# EAGLE design 454_mic (EAGLE 9.6.2)
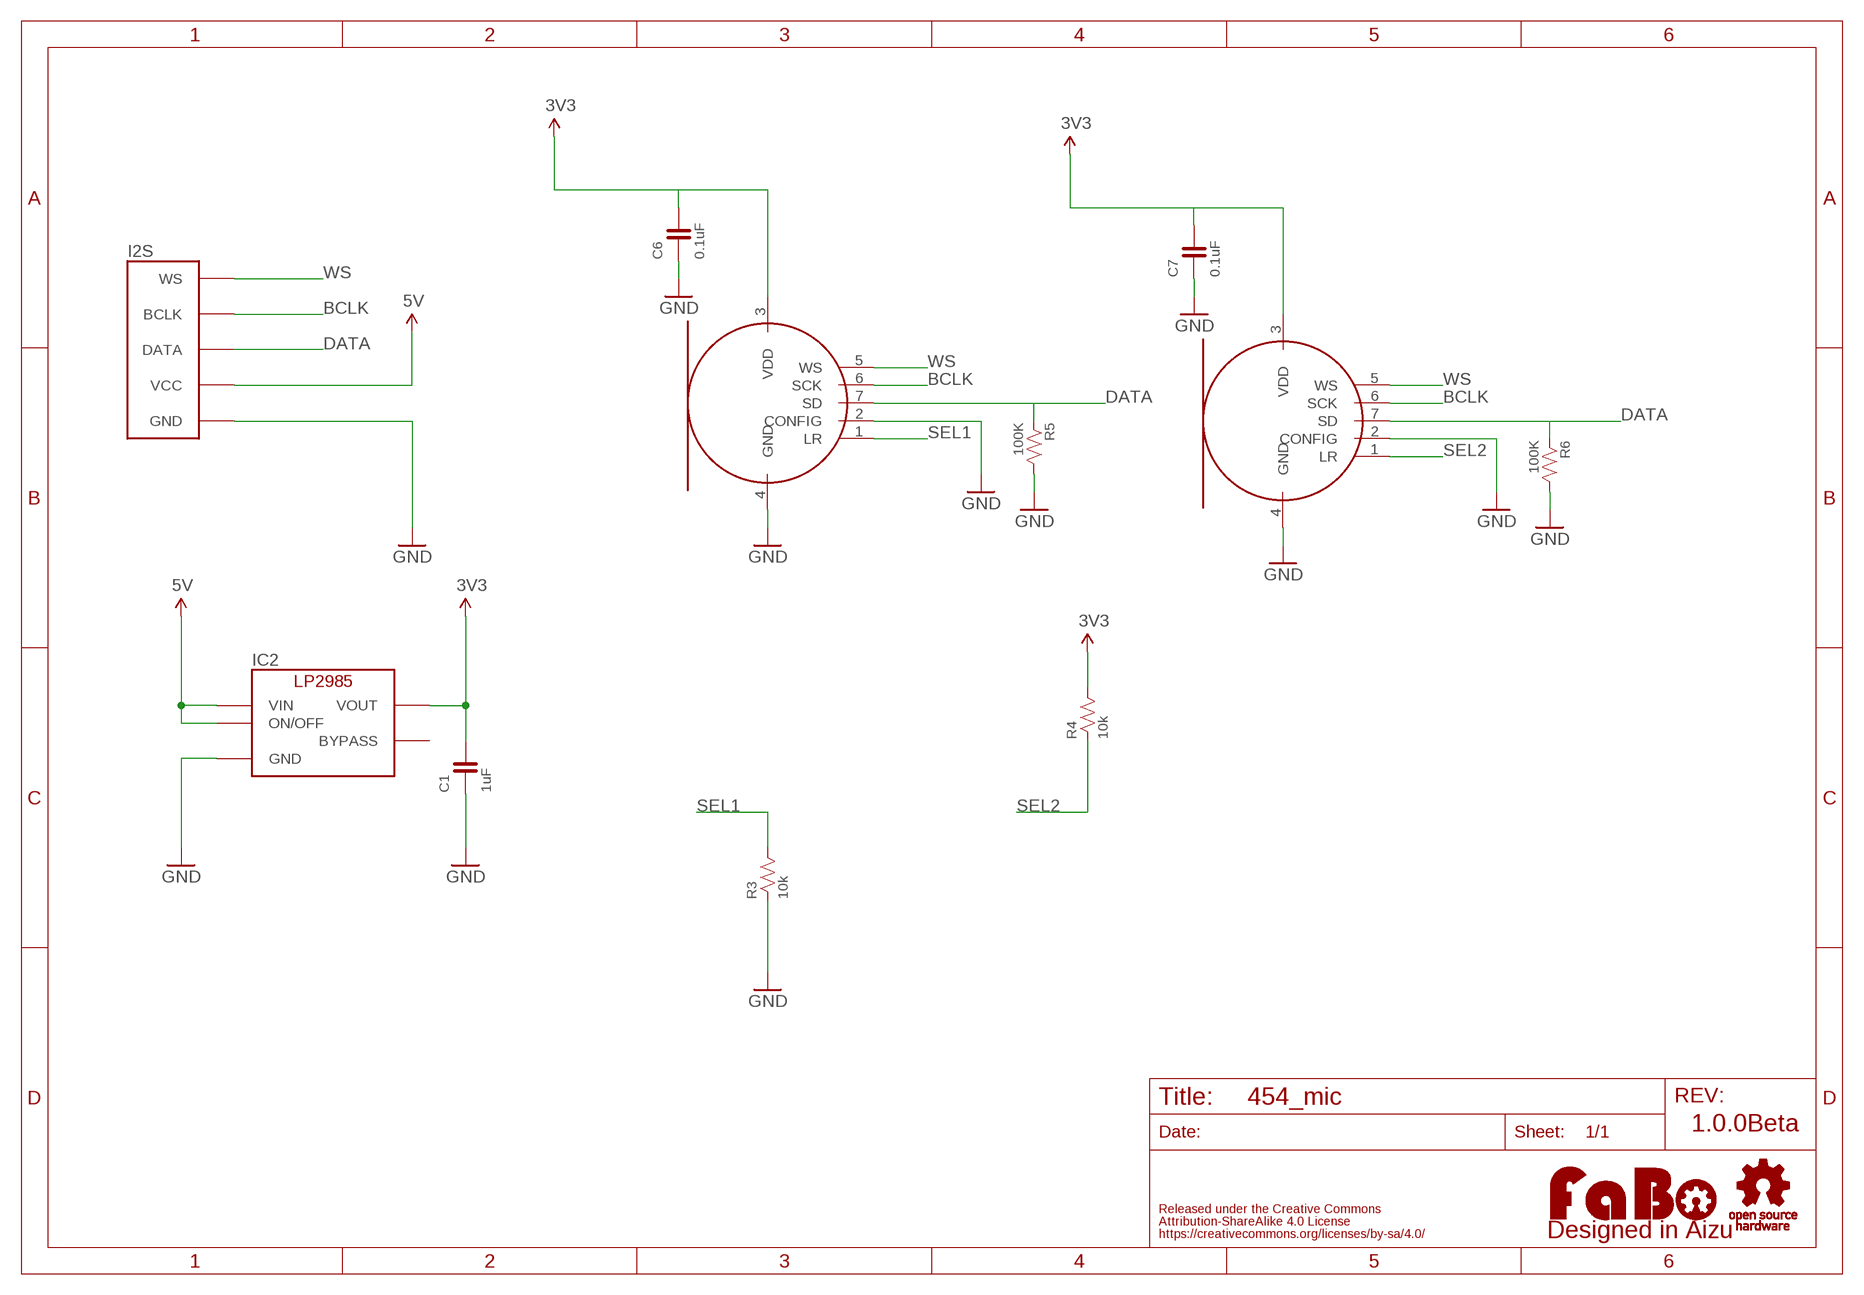
[diagram p0: schematic, sheet 1]

## Parts
C1  1uF  CAPACITOR-0603  [0603]
C6  0.1uF  CAPACITOR-0603  [0603]
C7  0.1uF  CAPACITOR-0603  [0603]
I2S  FABO_BRICK_I2STOP  [FABO_BRICK_I2S_B05B-PARK-1]
IC2  LP2985-33DBV  [SOT-23-5]
LOGO1  LOGO_FABO-M_BOTTOM  [LOGO_FABO_M_BOTTOM]
MIC_LEFT  TDK-ICS43432  [TDK-ICS43432]
MIC_RIGHT  TDK-ICS43432  [TDK-ICS43432]
R3  10k  RESISTOR-0603  [0603]
R4  10k  RESISTOR-0603  [0603]
R5  100K  RESISTOR-0603  [0603]
R6  100K  RESISTOR-0603  [0603]
U$2  LOGO_OSHW-M  [LOGO_OSHW_M]

## Nets
3V3: C1.2 C6.2 C7.2 IC2.5(VOUT) MIC_LEFT.3(VDD) MIC_RIGHT.3(VDD) R4.2
5V: I2S.VCC IC2.1(VIN) IC2.3(ON/OFF)
BCLK: I2S.BCLK MIC_LEFT.6(SCK) MIC_RIGHT.6(SCK)
DATA: I2S.DATA MIC_LEFT.7(SD) MIC_RIGHT.7(SD) R5.1 R6.1
GND: C1.1 C6.1 C7.1 I2S.GND IC2.2(GND) MIC_LEFT.2(CONFIG) MIC_LEFT.4(GND) MIC_RIGHT.2(CONFIG) MIC_RIGHT.4(GND) R3.1 R5.2 R6.2
SEL1: MIC_LEFT.1(LR) R3.2
SEL2: MIC_RIGHT.1(LR) R4.1
WS: I2S.WS MIC_LEFT.5(WS) MIC_RIGHT.5(WS)
Unconnected: IC2.4(BYPASS)

## Notes on the sheet
- 1.0.0Beta

## Library data of the parts
C1 C6 C7 = FaBo-Capacitor:CAPACITOR: CAPACITOR
I2S = FaBo-Template:FABO_BRICK_I2S
IC2 = FaBo-Supply:LP2985: LP2985
LOGO1 = component:LOGO_FABO
MIC_LEFT MIC_RIGHT = FaBo-Mems:TDK-ICS43432
R3-R6 = FaBo-Resistors:RESISTOR: RESISTOR
U$2 = component:LOGO_OSHW

## Board
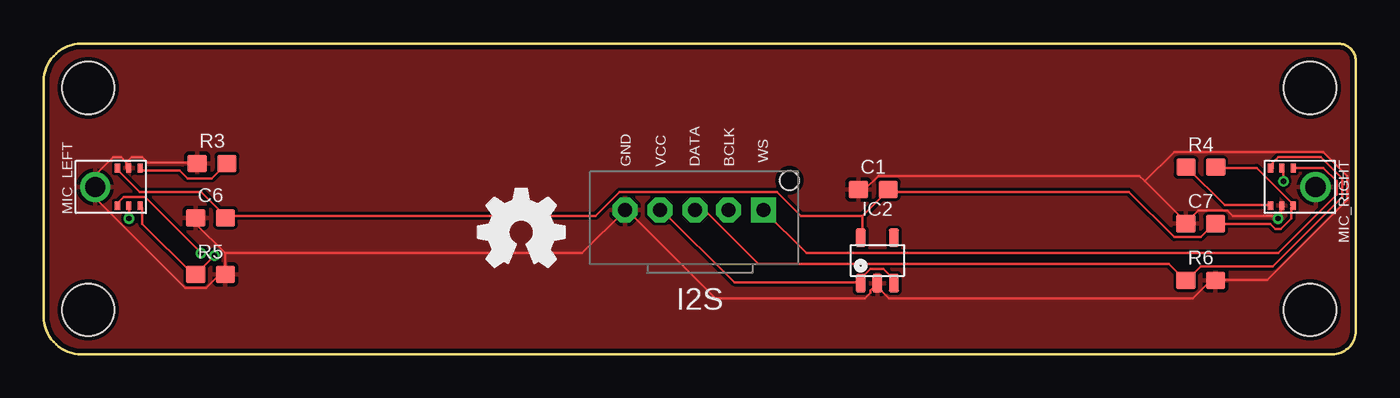
[diagram p1: board, top side]
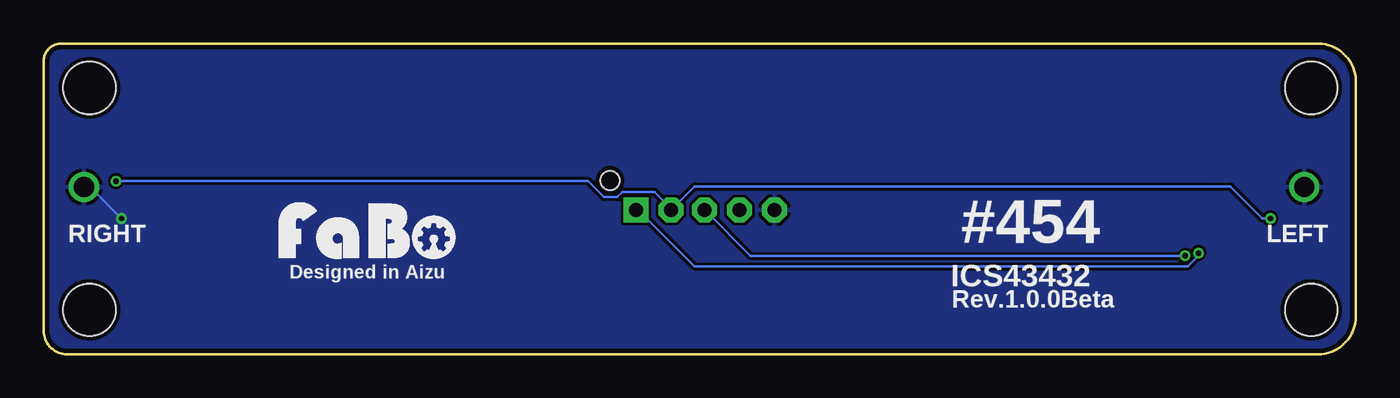
[diagram p2: board, bottom side, seen from below]

Size 75 x 17.77 mm. Coordinates in mm from the lower left corner, seen from the top.
Outline: 0,2.17 0,15.62 arc-90 2.15,17.77 74.01,17.77 arc-90 75,16.78 75,1.34 arc-90 73.66,0 2.17,0 arc-90 0,2.17
Copper layers (1*16): Top 0.035mm / dielectric 1.6mm / Bottom 0.035mm
Design rules "PCBway": minimum track width 6mil, minimum drill 12mil, track to track 6mil, track to pad 6mil, pad to pad 6mil, via to via 6mil, smd to smd 6mil, copper to edge 10mil, drill to drill 10mil, minimum pad ring 10mil, minimum via ring 6mil, stop-mask expansion 2mil, vias tented up to drill 100mil, thermal gap 8mil
Holes 3 mm at 2.54,2.54 2.54,15.24 72.39,15.24 72.39,2.54

### Footprints (pad centres in the part's own frame; a part is rotated, then mirrored left to right if it is on the bottom)
0603 = smd 1.1 x 1: 1 -0.85,0; 2 0.85,0
FABO_BRICK_I2S_B05B-PARK-1 = drill 0.8 pad 1.422 octagon: BCLK 1.635,2.54; DATA -0.27,2.54; GND -4.27,2.54; VCC -2.27,2.54 | drill 0.8 pad 1.422 square: WS 3.635,2.54 | hole 1.1: 5.135,4.24
SOT-23-5 = smd 0.6 x 1.05: 1 -0.95,-1.3; 2 0,-1.3; 3 0.95,-1.3; 4 0.95,1.3; 5 -0.95,1.3
TDK-ICS43432 = smd 0.5 x 0.3: 1 1.075,-2.575; 2 1.075,-1.925; 3 1.075,-1.275; 5 -1.075,-1.275; 6 -1.075,-1.925; 7 -1.075,-2.575 | drill 1.15 pad 1.65: 4 0,0

### Placement (x,y rotation side)
C1  47.41,9.43 0 top
C6  9.53,7.8 0 top
C7  66.14,7.47 0 top
I2S  37.5,5.71 0 top
IC2  47.65,5.37 0 top
LOGO1  56.52,5.08 0 top
MIC_LEFT  2.94,9.57 90 top
MIC_RIGHT  72.7,9.57 270 top
R3  9.62,10.91 0 top
R4  66.14,10.71 0 top
R5  9.53,4.57 0 top
R6  66.14,4.24 0 top
U$2  27.3,6.99 0 top

### Tracks (layer width: path | path; a pad name or v marks a point on that pad's centre or on a via)
3V3
  Top 0.152: MIC_LEFT.3 4.27,10.52 5.49,9.3 8.99,9.3 10.36,7.92 C6.2 10.52,7.92 31.55,7.92 32.92,9.3 41.91,9.3 43.28,7.92 46.79,7.92 | 46.79,7.92 46.79,6.71 IC2.5 | 46.79,7.92 48.16,9.3 C1.2 48.31,9.3 62.03,9.3 64.62,6.71 66.14,6.71 66.9,7.47 C7.2 67.06,7.47 70.1,7.47 70.41,7.16 70.71,7.16 71.32,7.77 71.32,8.38 MIC_RIGHT.3 71.32,8.53 71.32,8.69 69.34,10.67 67.06,10.67 R4.2
5V
  Top 0.152: IC2.3 48.46,4.12 48.46,4.42 48.01,4.88 47.24,4.88 46.79,4.42 46.79,4.12 IC2.1 46.63,4.12 39.47,4.12 35.36,8.23 I2S.VCC
BCLK  (via drill 0.3)
  Top 0.152: v4.88,7.77 4.88,8.38 MIC_LEFT.6 | v70.87,9.91 70.87,10.52 MIC_RIGHT.6
  Bottom 0.152: v4.88,7.77 5.33,7.77 7.16,9.6 37.8,9.6 39.01,8.38 I2S.BCLK 39.17,8.38 40.08,9.3 41.91,9.3 42.22,8.99 42.98,8.99 43.89,9.91 v70.87,9.91
DATA  (via drill 0.3)
  Top 0.152: MIC_LEFT.7 5.64,8.38 5.64,7.47 8.53,4.57 R5.1 v9.75,5.64 | MIC_RIGHT.7 70.26,10.67 70.26,10.97 70.56,11.28 73,11.28 74.22,10.06 74.22,8.99 70.26,5.03 66.14,5.03 65.38,4.27 R6.1 65.23,4.27 64.31,5.18 40.84,5.18 37.8,8.23 37.34,8.23 I2S.DATA
  Bottom 0.152: v9.75,5.64 34.59,5.64 37.19,8.23 I2S.DATA
GND  (via drill 0.3)
  Top 0.152: 70.41,7.92 70.71,8.23 70.71,8.38 MIC_RIGHT.2 | 70.41,7.92 67.97,7.92 67.67,8.23 65.99,8.23 65.38,7.62 C7.1 65.23,7.62 62.94,9.91 | 62.94,9.91 62.64,10.21 47.7,10.21 46.94,9.45 46.63,9.45 C1.1 | 70.41,7.92 v70.56,7.77 | 10.36,5.79 8.69,7.47 8.69,7.77 C6.1 | 10.36,5.79 10.36,4.57 R5.2 10.36,4.42 9.91,4.42 9.3,3.81 8.08,3.81 3.05,8.84 3.05,9.45 MIC_LEFT.4 3.05,9.6 3.05,10.36 3.96,11.28 4.42,11.28 4.72,10.97 | 4.72,10.97 4.72,10.67 MIC_LEFT.2 | 4.72,10.97 5.03,11.28 5.64,11.28 5.94,10.97 8.69,10.97 R3.1 | 47.55,3.96 47.24,3.66 47.24,3.5 46.94,3.2 38.41,3.2 33.38,8.23 I2S.GND 33.22,8.23 30.79,5.79 10.36,5.79 | 47.55,3.96 48.31,3.2 65.68,3.2 66.6,4.12 66.9,4.12 R6.2 67.06,4.27 69.95,4.27 74.52,8.84 74.52,10.21 73.15,11.58 64.62,11.58 62.94,9.91 | 47.55,3.96 IC2.2
  Bottom 0.152: v70.56,7.77 72.24,9.45 72.69,9.45 MIC_RIGHT.4
  pour Top: 0,0 74.93,0 74.93,17.78 0,17.78
  pour Bottom: 0,0 74.93,0 74.93,17.78 0,17.78
SEL1
  Top 0.152: MIC_LEFT.1 5.64,10.52 7.77,10.52 8.23,10.06 9.6,10.06 10.36,10.82 R3.2
SEL2
  Top 0.152: MIC_RIGHT.1 70.1,8.53 67.51,8.53 65.38,10.67 R4.1
WS  (via drill 0.3)
  Top 0.152: v8.99,5.79 5.79,8.99 4.57,8.99 4.27,8.69 4.27,8.53 MIC_LEFT.5 | MIC_RIGHT.5 71.48,10.67 73.15,10.67 73.91,9.91 73.91,9.14 70.56,5.79 43.59,5.79 41.15,8.23 I2S.WS
  Bottom 0.152: v8.99,5.79 8.99,5.64 9.6,5.03 37.8,5.03 41,8.23 I2S.WS

### Text on the board
tPlace: GND | VCC | DATA | BCLK | WS
bPlace: LEFT | #454 | RIGHT | Designed in Aizu | ICS43432 | Rev.1.0.0Beta